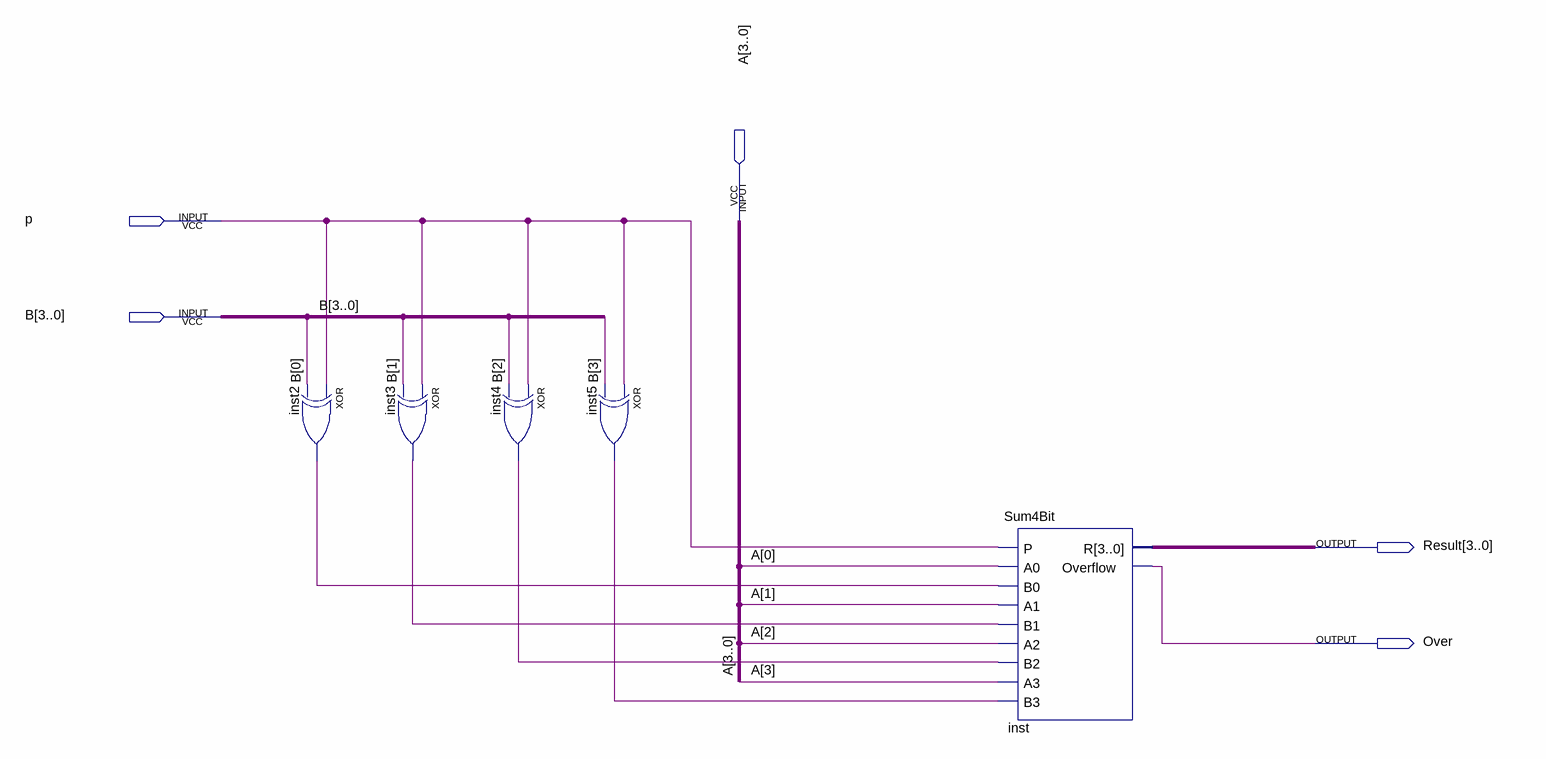
[diagram p0: schematic sheet]
// Quartus schematic Fon.bdf as structural Verilog: 5 symbols, 5 pins
module Fon (
  input  p,
  input  [3:0] A,
  input  [3:0] B,
  output [3:0] Result,
  output Over
);

  wire inst2_out, inst3_out, inst4_out, inst5_out;

  xor inst2 (inst2_out, p, B[0]);
  xor inst3 (inst3_out, p, B[1]);
  xor inst4 (inst4_out, p, B[2]);
  xor inst5 (inst5_out, p, B[3]);
  Sum4Bit inst (
    .P(p), .A0(A[0]), .B0(inst2_out), .A1(A[1]), .B1(inst3_out), .A2(A[2]), .B2(inst4_out), .A3(A[3]),
    .B3(inst5_out), .R(Result), .Overflow(Over));
endmodule
